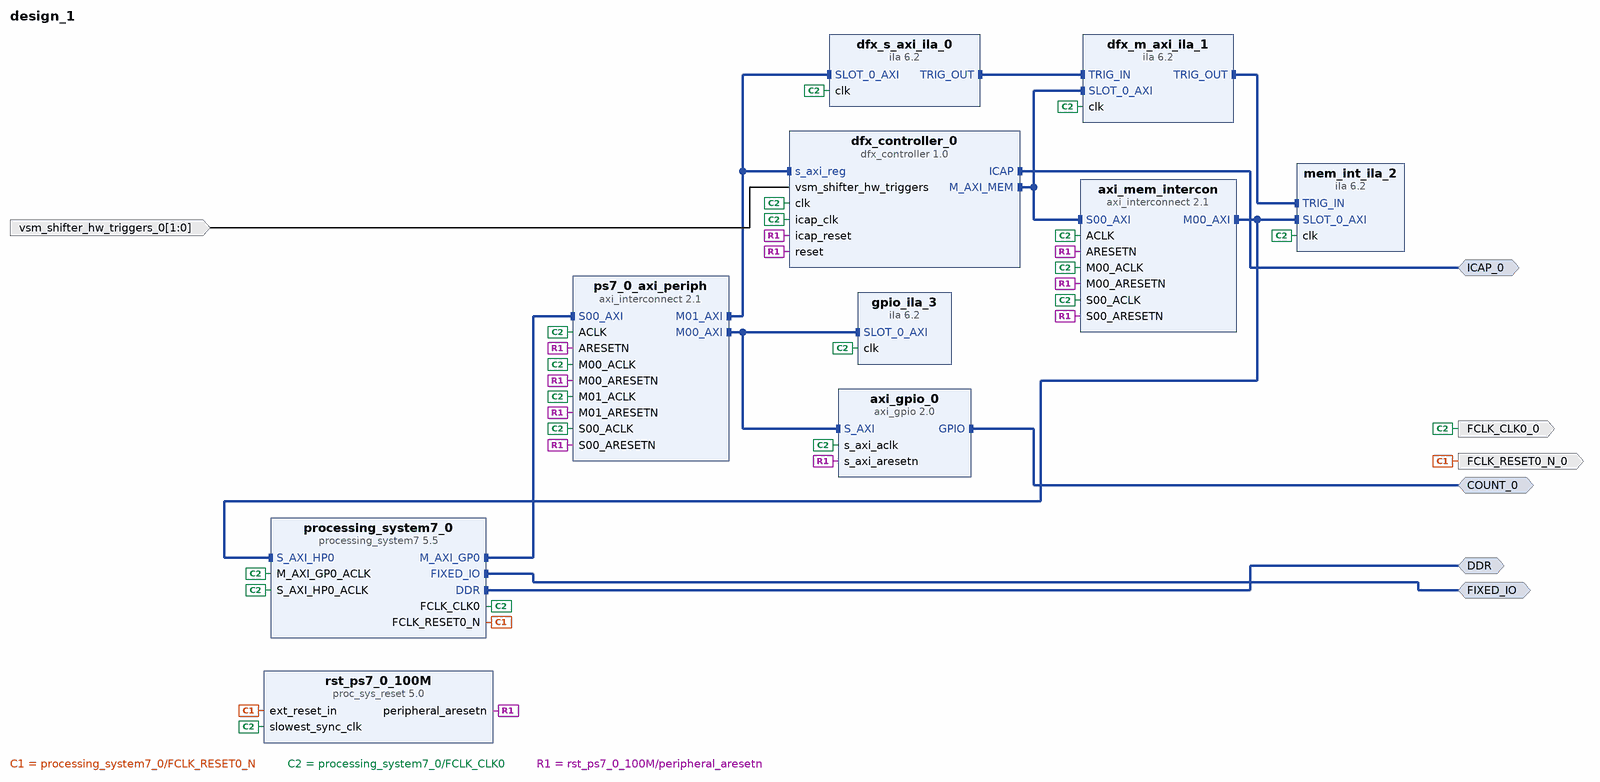
[diagram p0: block diagram of the top level]
# Vivado block design design_1, xc7z020clg400-1, Vivado 2020.1
create_bd_design design_1

create_bd_intf_port -mode Master -vlnv xilinx.com:interface:ddrx_rtl:1.0 DDR
create_bd_intf_port -mode Master -vlnv xilinx.com:display_processing_system7:fixedio_rtl:1.0 FIXED_IO
create_bd_intf_port -mode Master -vlnv xilinx.com:interface:icap_rtl:1.0 ICAP_0
create_bd_intf_port -mode Master -vlnv xilinx.com:interface:gpio_rtl:1.0 COUNT_0
create_bd_port -dir O -type rst FCLK_RESET0_N_0
create_bd_port -dir O -type clk FCLK_CLK0_0
create_bd_port -dir I -from 1 -to 0 vsm_shifter_hw_triggers_0

create_bd_cell -type ip -vlnv xilinx.com:ip:processing_system7:5.5 processing_system7_0
set_property -dict [list \
  CONFIG.PCW_APU_PERIPHERAL_FREQMHZ 650 \
  CONFIG.PCW_CRYSTAL_PERIPHERAL_FREQMHZ 50 \
  CONFIG.PCW_ENET0_ENET0_IO {MIO 16 .. 27} \
  CONFIG.PCW_ENET0_GRP_MDIO_ENABLE 1 \
  CONFIG.PCW_ENET0_GRP_MDIO_IO {MIO 52 .. 53} \
  CONFIG.PCW_ENET0_PERIPHERAL_ENABLE 1 \
  CONFIG.PCW_ENET0_RESET_ENABLE 1 \
  CONFIG.PCW_ENET0_RESET_IO {MIO 9} \
  CONFIG.PCW_ENET_RESET_ENABLE 1 \
  CONFIG.PCW_ENET_RESET_SELECT {Share reset pin} \
  CONFIG.PCW_FPGA0_PERIPHERAL_FREQMHZ 100 \
  CONFIG.PCW_FPGA1_PERIPHERAL_FREQMHZ 50 \
  CONFIG.PCW_GPIO_MIO_GPIO_ENABLE 1 \
  CONFIG.PCW_GPIO_MIO_GPIO_IO MIO \
  CONFIG.PCW_I2C_RESET_ENABLE 1 \
  CONFIG.PCW_M_AXI_GP0_FREQMHZ 10 \
  CONFIG.PCW_PERIPHERAL_BOARD_PRESET part0 \
  CONFIG.PCW_PRESET_BANK1_VOLTAGE {LVCMOS 1.8V} \
  CONFIG.PCW_QSPI_GRP_FBCLK_ENABLE 1 \
  CONFIG.PCW_QSPI_GRP_FBCLK_IO {MIO 8} \
  CONFIG.PCW_QSPI_GRP_SINGLE_SS_ENABLE 1 \
  CONFIG.PCW_QSPI_GRP_SINGLE_SS_IO {MIO 1 .. 6} \
  CONFIG.PCW_QSPI_PERIPHERAL_ENABLE 1 \
  CONFIG.PCW_QSPI_QSPI_IO {MIO 1 .. 6} \
  CONFIG.PCW_SD0_GRP_CD_ENABLE 1 \
  CONFIG.PCW_SD0_GRP_CD_IO {MIO 47} \
  CONFIG.PCW_SD0_GRP_WP_ENABLE 0 \
  CONFIG.PCW_SD0_PERIPHERAL_ENABLE 1 \
  CONFIG.PCW_SD0_SD0_IO {MIO 40 .. 45} \
  CONFIG.PCW_SDIO_PERIPHERAL_FREQMHZ 50 \
  CONFIG.PCW_SINGLE_QSPI_DATA_MODE x4 \
  CONFIG.PCW_S_AXI_HP0_FREQMHZ 10 \
  CONFIG.PCW_UART0_PERIPHERAL_ENABLE 1 \
  CONFIG.PCW_UART0_UART0_IO {MIO 14 .. 15} \
  CONFIG.PCW_UART1_PERIPHERAL_ENABLE 0 \
  CONFIG.PCW_UART_PERIPHERAL_FREQMHZ 100 \
  CONFIG.PCW_UIPARAM_DDR_BUS_WIDTH {16 Bit} \
  CONFIG.PCW_UIPARAM_DDR_FREQ_MHZ 525 \
  CONFIG.PCW_UIPARAM_DDR_PARTNO {MT41J256M16 RE-125} \
  CONFIG.PCW_USB0_PERIPHERAL_ENABLE 1 \
  CONFIG.PCW_USB0_RESET_ENABLE 1 \
  CONFIG.PCW_USB0_RESET_IO {MIO 46} \
  CONFIG.PCW_USB0_USB0_IO {MIO 28 .. 39} \
  CONFIG.PCW_USB_RESET_ENABLE 1 \
  CONFIG.PCW_USB_RESET_SELECT {Share reset pin} \
  CONFIG.PCW_USE_S_AXI_HP0 1 \
] [get_bd_cells processing_system7_0]
# 486 more settings of processing_system7_0 are not shown: defaults, MIO pin electricals, DDR timing, and values the tool derives
create_bd_cell -type ip -vlnv xilinx.com:ip:dfx_controller:1.0 dfx_controller_0
set_property -dict [list \
  CONFIG.ALL_PARAMS {HAS_AXI_LITE_IF 1 RESET_ACTIVE_LEVEL 0 CP_FIFO_DEPTH 32 CP_FIFO_TYPE lutram CDC_STAGES 2 VS {shifter {ID 0 NAME shifter RM {shift_left {ID 0 NAME shift_left BS {0 {ID 0 ADDR 0 SIZE 0 CLEAR 0}} RESET_REQUIRED high} shift_right {ID 1 NAME shift_right BS {0 {ID 0 ADDR 0 SIZE 0 CLEAR 0}}}} POR_RM shift_left HAS_POR_RM 1 SHUTDOWN_ON_ERROR 0 HAS_AXIS_STATUS 0 HAS_AXIS_CONTROL 0 SKIP_RM_STARTUP_AFTER_RESET 0 NUM_HW_TRIGGERS 2}} CP_FAMILY 7series DIRTY 0 CP_ARBITRATION_PROTOCOL 1} \
  CONFIG.GUI_CDC_STAGES 2 \
  CONFIG.GUI_CP_ARBITRATION_PROTOCOL 1 \
  CONFIG.GUI_HAS_AXI_LITE true \
  CONFIG.GUI_RESET_ACTIVE_LEVEL 0 \
  CONFIG.GUI_RM_NEW_NAME shift_left \
  CONFIG.GUI_RM_RESET_REQUIRED high \
  CONFIG.GUI_SELECT_RM 0 \
  CONFIG.GUI_SELECT_TRIGGER_1 1 \
  CONFIG.GUI_SELECT_TRIGGER_3 1 \
  CONFIG.GUI_VS_HAS_AXIS_CONTROL false \
  CONFIG.GUI_VS_HAS_AXIS_STATUS false \
  CONFIG.GUI_VS_HAS_POR_RM true \
  CONFIG.GUI_VS_NEW_NAME shifter \
  CONFIG.GUI_VS_NUM_HW_TRIGGERS 2 \
  CONFIG.GUI_VS_SHUTDOWN_ON_ERROR false \
  CONFIG.GUI_VS_SKIP_RM_STARTUP_AFTER_RESET false \
] [get_bd_cells dfx_controller_0]
create_bd_cell -type ip -vlnv xilinx.com:ip:proc_sys_reset:5.0 rst_ps7_0_100M
create_bd_cell -type ip -vlnv xilinx.com:ip:ila:6.2 dfx_s_axi_ila_0
set_property -dict {CONFIG.C_TRIGIN_EN false CONFIG.C_TRIGOUT_EN true} [get_bd_cells dfx_s_axi_ila_0]
create_bd_cell -type ip -vlnv xilinx.com:ip:axi_gpio:2.0 axi_gpio_0
set_property -dict [list \
  CONFIG.C_ALL_OUTPUTS 1 \
  CONFIG.C_DOUT_DEFAULT 0x05F5E100 \
  CONFIG.C_GPIO_WIDTH 32 \
  CONFIG.GPIO_BOARD_INTERFACE Custom \
  CONFIG.USE_BOARD_FLOW true \
] [get_bd_cells axi_gpio_0]
create_bd_cell -type ip -vlnv xilinx.com:ip:ila:6.2 dfx_m_axi_ila_1
set_property -dict {CONFIG.C_TRIGIN_EN true CONFIG.C_TRIGOUT_EN true} [get_bd_cells dfx_m_axi_ila_1]
create_bd_cell -type ip -vlnv xilinx.com:ip:ila:6.2 mem_int_ila_2
set_property -dict {CONFIG.C_TRIGIN_EN true CONFIG.C_TRIGOUT_EN false} [get_bd_cells mem_int_ila_2]
create_bd_cell -type ip -vlnv xilinx.com:ip:ila:6.2 gpio_ila_3
set_property -dict {CONFIG.C_TRIGIN_EN false CONFIG.C_TRIGOUT_EN false} [get_bd_cells gpio_ila_3]
create_bd_cell -type ip -vlnv xilinx.com:ip:axi_interconnect:2.1 ps7_0_axi_periph
set_property -dict {CONFIG.NUM_MI 2} [get_bd_cells ps7_0_axi_periph]
create_bd_cell -type ip -vlnv xilinx.com:ip:axi_interconnect:2.1 axi_mem_intercon
set_property -dict {CONFIG.NUM_MI 1} [get_bd_cells axi_mem_intercon]

# ---- connections ----

connect_bd_intf_net [get_bd_intf_pins dfx_controller_0/M_AXI_MEM] [get_bd_intf_pins axi_mem_intercon/S00_AXI]
connect_bd_intf_net [get_bd_intf_pins dfx_controller_0/M_AXI_MEM] [get_bd_intf_pins dfx_m_axi_ila_1/SLOT_0_AXI]
connect_bd_intf_net [get_bd_intf_pins ps7_0_axi_periph/M00_AXI] [get_bd_intf_pins axi_gpio_0/S_AXI]
connect_bd_intf_net [get_bd_intf_pins ps7_0_axi_periph/M00_AXI] [get_bd_intf_pins gpio_ila_3/SLOT_0_AXI]
connect_bd_intf_net [get_bd_intf_pins processing_system7_0/M_AXI_GP0] [get_bd_intf_pins ps7_0_axi_periph/S00_AXI]
connect_bd_intf_net [get_bd_intf_pins dfx_m_axi_ila_1/TRIG_OUT] [get_bd_intf_pins mem_int_ila_2/TRIG_IN]
connect_bd_intf_net [get_bd_intf_pins dfx_s_axi_ila_0/TRIG_OUT] [get_bd_intf_pins dfx_m_axi_ila_1/TRIG_IN]
connect_bd_intf_net [get_bd_intf_ports COUNT_0] [get_bd_intf_pins axi_gpio_0/GPIO]
connect_bd_intf_net [get_bd_intf_ports FIXED_IO] [get_bd_intf_pins processing_system7_0/FIXED_IO]
connect_bd_intf_net [get_bd_intf_pins ps7_0_axi_periph/M01_AXI] [get_bd_intf_pins dfx_controller_0/s_axi_reg]
connect_bd_intf_net [get_bd_intf_pins ps7_0_axi_periph/M01_AXI] [get_bd_intf_pins dfx_s_axi_ila_0/SLOT_0_AXI]
connect_bd_intf_net [get_bd_intf_ports ICAP_0] [get_bd_intf_pins dfx_controller_0/ICAP]
connect_bd_intf_net [get_bd_intf_ports DDR] [get_bd_intf_pins processing_system7_0/DDR]
connect_bd_intf_net [get_bd_intf_pins axi_mem_intercon/M00_AXI] [get_bd_intf_pins processing_system7_0/S_AXI_HP0]
connect_bd_intf_net [get_bd_intf_pins axi_mem_intercon/M00_AXI] [get_bd_intf_pins mem_int_ila_2/SLOT_0_AXI]
connect_bd_net [get_bd_pins processing_system7_0/FCLK_RESET0_N] [get_bd_ports FCLK_RESET0_N_0] [get_bd_pins rst_ps7_0_100M/ext_reset_in]
connect_bd_net [get_bd_pins processing_system7_0/FCLK_CLK0] \
  [get_bd_ports FCLK_CLK0_0] [get_bd_pins processing_system7_0/M_AXI_GP0_ACLK] [get_bd_pins rst_ps7_0_100M/slowest_sync_clk] \
  [get_bd_pins dfx_controller_0/clk] [get_bd_pins dfx_controller_0/icap_clk] [get_bd_pins dfx_s_axi_ila_0/clk] \
  [get_bd_pins processing_system7_0/S_AXI_HP0_ACLK] [get_bd_pins axi_gpio_0/s_axi_aclk] [get_bd_pins dfx_m_axi_ila_1/clk] \
  [get_bd_pins mem_int_ila_2/clk] [get_bd_pins gpio_ila_3/clk] [get_bd_pins ps7_0_axi_periph/ACLK] \
  [get_bd_pins ps7_0_axi_periph/S00_ACLK] [get_bd_pins ps7_0_axi_periph/M00_ACLK] [get_bd_pins ps7_0_axi_periph/M01_ACLK] \
  [get_bd_pins axi_mem_intercon/ACLK] [get_bd_pins axi_mem_intercon/S00_ACLK] [get_bd_pins axi_mem_intercon/M00_ACLK]
connect_bd_net [get_bd_pins rst_ps7_0_100M/peripheral_aresetn] \
  [get_bd_pins dfx_controller_0/reset] [get_bd_pins dfx_controller_0/icap_reset] [get_bd_pins axi_gpio_0/s_axi_aresetn] \
  [get_bd_pins ps7_0_axi_periph/S00_ARESETN] [get_bd_pins ps7_0_axi_periph/M00_ARESETN] \
  [get_bd_pins ps7_0_axi_periph/ARESETN] [get_bd_pins ps7_0_axi_periph/M01_ARESETN] \
  [get_bd_pins axi_mem_intercon/S00_ARESETN] [get_bd_pins axi_mem_intercon/M00_ARESETN] \
  [get_bd_pins axi_mem_intercon/ARESETN]
connect_bd_net -net vsm_shifter_hw_triggers_0_1 [get_bd_ports vsm_shifter_hw_triggers_0] [get_bd_pins dfx_controller_0/vsm_shifter_hw_triggers]

# ---- address map ----
assign_bd_address -offset 0x10000000 -range 256M -target_address_space [get_bd_addr_spaces dfx_controller_0/Data] [get_bd_addr_segs processing_system7_0/S_AXI_HP0/HP0_DDR_LOWOCM]
assign_bd_address -offset 0x41200000 -range 64K -target_address_space [get_bd_addr_spaces processing_system7_0/Data] [get_bd_addr_segs axi_gpio_0/S_AXI/Reg]
assign_bd_address -offset 0x43C10000 -range 64K -target_address_space [get_bd_addr_spaces processing_system7_0/Data] [get_bd_addr_segs dfx_controller_0/s_axi_reg/Reg]

validate_bd_design
save_bd_design
